# EAGLE design rfid_ctl2 (EAGLE 7.5.0)
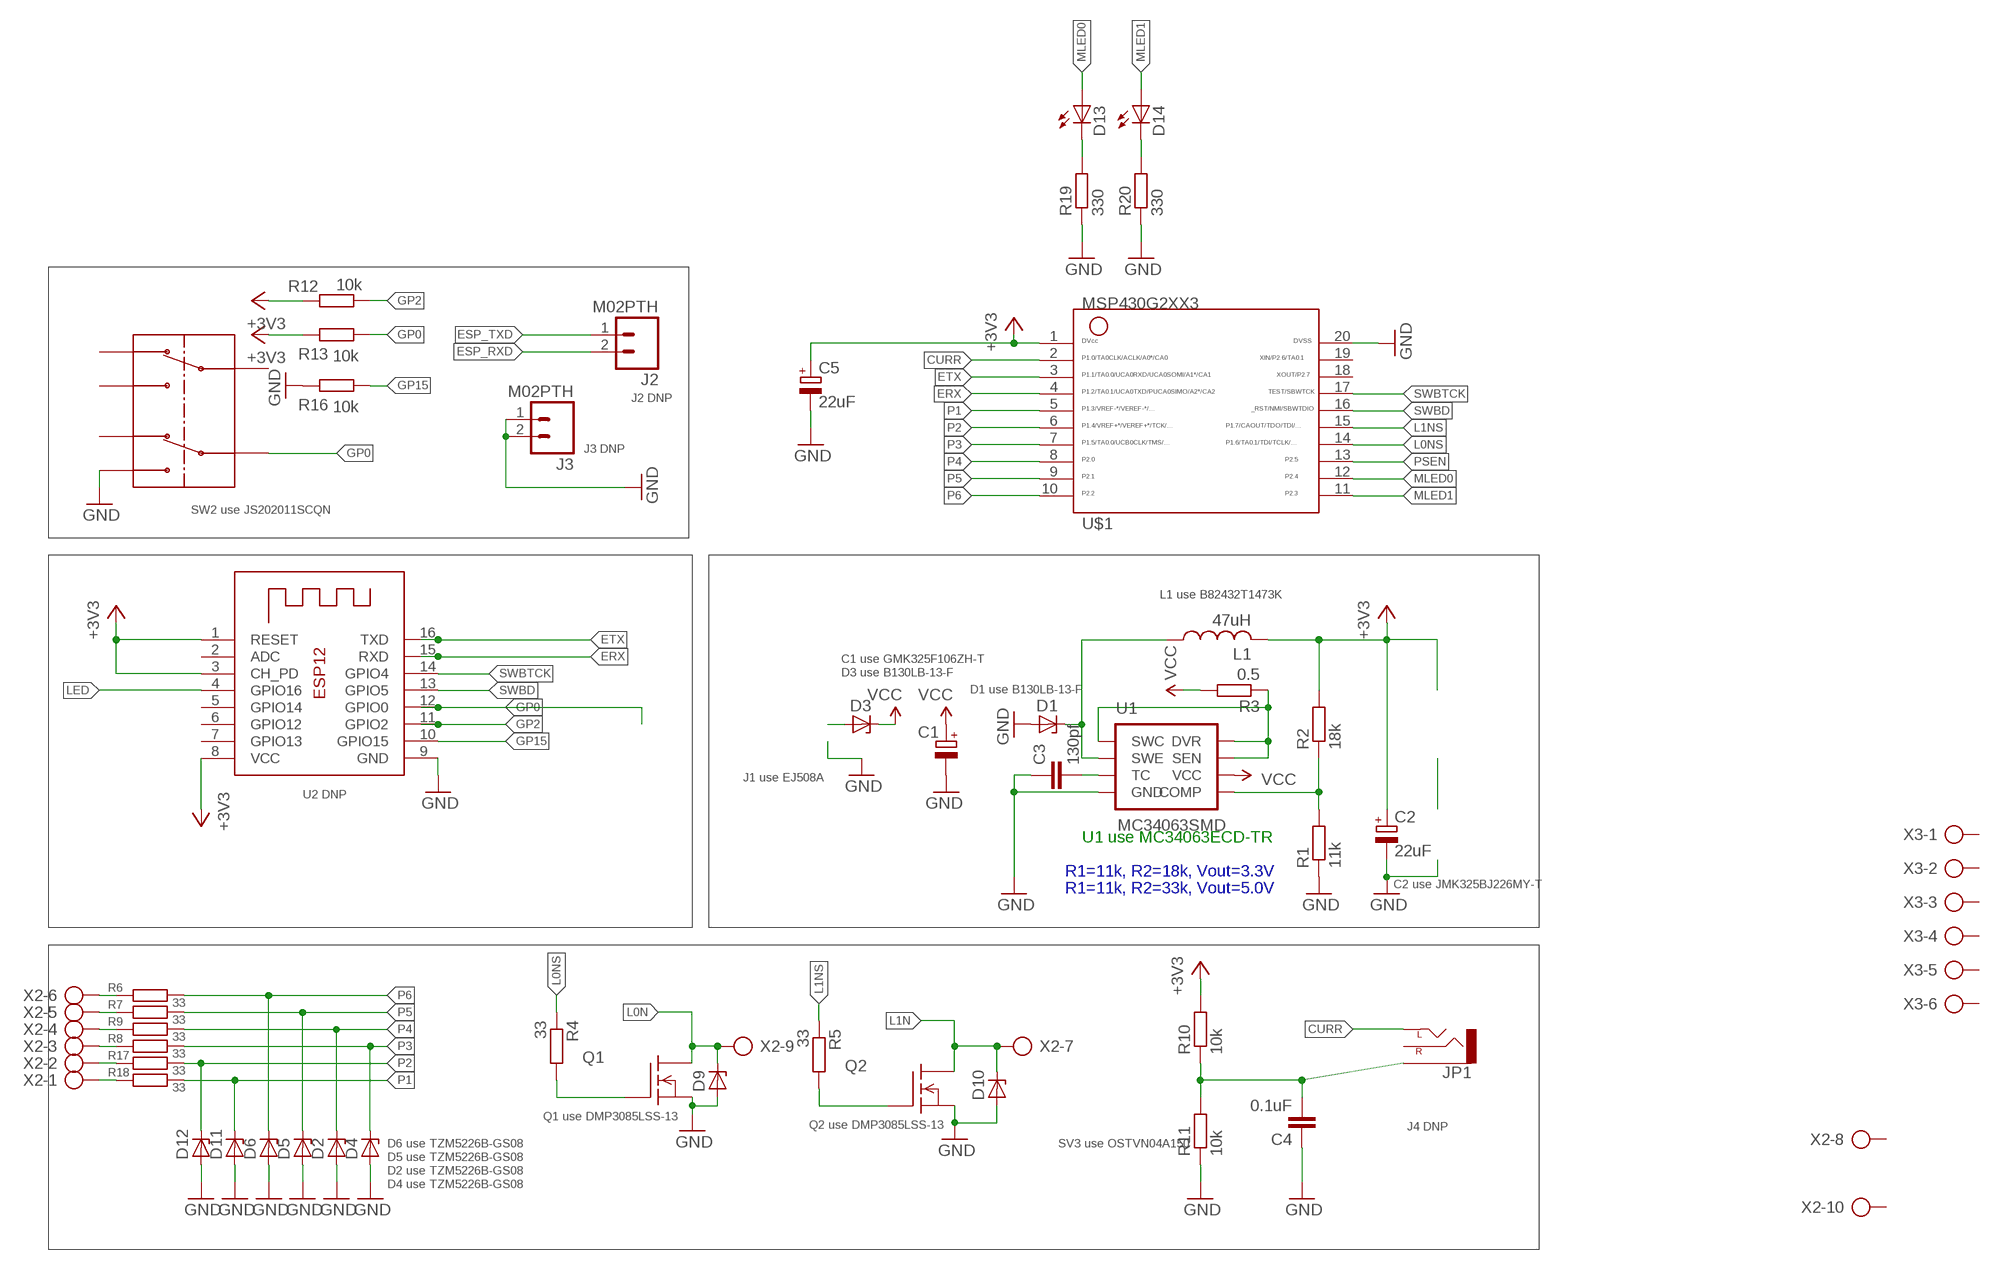
[diagram p0: schematic, sheet 1]

## Parts
C1  CPOL-EUE2.5-7  [E2,5-7]
C2  22uF  CPOL-EUE2.5-7  [E2,5-7]
C3  130pf  C-EUC0805  [C0805]
C4  0.1uF  C-EUC0603  [C0603]
C5  22uF  CPOL-EUE1.8-4  [E1,8-4]
D1  ZENER-DIODESMB  [SMB]
D2  ZENER-DIODESOD80C  [SOD80C]
D3  ZENER-DIODESMB  [SMB]
D4  ZENER-DIODESOD80C  [SOD80C]
D5  ZENER-DIODESOD80C  [SOD80C]
D6  ZENER-DIODESOD80C  [SOD80C]
D9  ZENER-DIODESMB  [SMB]
D10  ZENER-DIODESMB  [SMB]
D11  ZENER-DIODESOD80C  [SOD80C]
D12  ZENER-DIODESOD80C  [SOD80C]
D13  LED5MM  [LED5MM]
D14  LED5MM  [LED5MM]
J2  M02PTH  [1X02]
J3  M02PTH  [1X02]
JP1  AUDIO-JACKSMD2  [AUDIO-JACK-3.5MM-SMD]
L1  47uH  L-USL1812  [L1812]
Q1  FDS5680  [SO-8]
Q2  FDS5680  [SO-8]
R1  11k  R-EU_R0805  [R0805]
R2  18k  R-EU_R0805  [R0805]
R3  0.5  R-EU_R0805  [R0805]
R4  33  R-EU_R0805  [R0805]
R5  33  R-EU_R0805  [R0805]
R6  33  R-EU_R1206  [R1206]
R7  33  R-EU_R1206  [R1206]
R8  33  R-EU_R1206  [R1206]
R9  33  R-EU_R1206  [R1206]
R10  10k  R-EU_R0603  [R0603]
R11  10k  R-EU_R0603  [R0603]
R12  10k  R-EU_R0805  [R0805]
R13  10k  R-EU_R0805  [R0805]
R16  10k  R-EU_R0603  [R0603]
R17  33  R-EU_R1206  [R1206]
R18  33  R-EU_R1206  [R1206]
R19  330  R-EU_R0805  [R0805]
R20  330  R-EU_R0805  [R0805]
SW2  L202011MS02Q  [SMT]
U1  MC34063SMD  [SO08]
U2  ESP-12  [ESP-12]
U$1  G2XX3---N20  [N20]
X2  AK300/10  [AK300/10]
X3  AK300/6  [AK300/6]

## Nets
+3V3: C2.+ C5.+ L1.2 R2.2 R10.2 R12.2 R13.2 U2.1(RESET) U2.3(CH_PD) U2.8(VCC) U$1.1
CURR: JP1.TIP(LEFT) U$1.2
ERX: U2.15(RXD) U$1.4
ESP_RXD: J2.2
ESP_TXD: J2.1
ETX: U2.16(TXD) U$1.3
GND: C1.- C2.- C3.1 C4.1 C5.- D1.A D2.A D4.A D5.A D6.A D9.A D10.A D11.A D12.A J3.1 J3.2 Q1.1(S) Q1.2(S) Q1.3(S) Q2.1(S) Q2.2(S) Q2.3(S) R1.1 R11.1 R16.2 R19.1 R20.1 SW2.B1 U1.4(GND) U2.9(GND) U$1.20
GP0: R13.1 SW2.B U2.12(GPIO0)
GP2: R12.1 U2.11(GPIO2)
GP15: R16.1 U2.10(GPIO15)
L0N: D9.C Q1.5(D) Q1.6(D) Q1.7(D) Q1.8(D) X2.9
L0NS: R4.1 U$1.14
L1N: D10.C Q2.5(D) Q2.6(D) Q2.7(D) Q2.8(D) X2.7
L1NS: R5.1 U$1.15
LED: U2.4(GPIO16)
MLED0: D13.A U$1.12
MLED1: D14.A U$1.11
N$1: Q1.4(G) R4.2
N$2: C3.2 U1.3(TC)
N$3: D1.C L1.1 U1.2(SWE)
N$4: Q2.4(G) R5.2
N$5: R1.2 R2.1 U1.5(COMP)
N$6: R3.1 U1.1(SWC) U1.7(SEN) U1.8(DVR)
N$7: D3.A
N$8: R6.1 X2.6
N$9: R7.1 X2.5
N$10: R8.1 X2.4
N$11: R9.1 X2.3
N$12: C4.2 JP1.SLEEVE R10.1 R11.2
N$15: D13.K(C) R19.2
N$16: D14.K(C) R20.2
N$17: R17.1 X2.2
N$18: R18.1 X2.1
P1: D11.C R18.2 U$1.5
P2: D12.C R17.2 U$1.6
P3: D4.C R9.2 U$1.7
P4: D2.C R8.2 U$1.8
P5: D5.C R7.2 U$1.9
P6: D6.C R6.2 U$1.10
PSEN: U$1.13
SWBD: U2.13(GPIO5) U$1.16
SWBTCK: U2.14(GPIO4) U$1.17
VCC: C1.+ D3.C R3.2 U1.6(VCC)
Unconnected: JP1.RING(RIGHT) SW2.A SW2.A1 SW2.A2 SW2.B2 U2.2(ADC) U2.5(GPIO14) U2.6(GPIO12) U2.7(GPIO13) U$1.18 U$1.19 X2.8 X2.10 X3.1 X3.2 X3.3 X3.4 X3.5 X3.6

## Notes on the sheet
- J2 DNP
- J3 DNP
- SW2 use JS202011SCQN
- L1 use B82432T1473K
- C1 use GMK325F106ZH-T
- D3 use B130LB-13-F
- D1 use B130LB-13-F
- J1 use EJ508A
- U2 DNP
- U1 use MC34063ECD-TR
- R1=11k, R2=18k, Vout=3.3V
- C2 use JMK325BJ226MY-T
- R1=11k, R2=33k, Vout=5.0V
- Q1 use DMP3085LSS-13
- Q2 use DMP3085LSS-13 | J4 DNP
- D6 use TZM5226B-GS08 | SV3 use OSTVN04A150
- D5 use TZM5226B-GS08
- D2 use TZM5226B-GS08
- D4 use TZM5226B-GS08

## Library data of the parts
C1 C2 C5 = rcl:CPOL-EU: POLARIZED CAPACITOR, European symbol
C3 C4 = rcl:C-EU: CAPACITOR, European symbol
D1-D6 D9-D12 = diode:ZENER-DIODE: Z-Diode
D13 D14 = adafruit:LED: LED OSRAM: - CHIPLED LG R971, LG N971, LY N971, LG Q971, LY Q971, LO R971, LY R971 LH N974, LH R974 LS Q976, LO Q976, LY Q976 LO Q996 - Hyper CHIPLED LW Q18S LB Q993, LB Q99A, LB R99A - SideLED LS A670, LO A670, LY A670, LG A670, LP A670 LB A673, LV A673, LT A673, LW A673 LH A674 LY A675 LS A676, LA A676, LO A676, LY A676, LW A676 LS A679, LY A679, LG A679 - Hyper Micro SIDELED® LS Y876, LA Y876, LO Y876, LY Y876 LT Y87S - SmartLED LW L88C, LW L88S LB L89C, LB L89S, LG L890 LS L89K, LO L89K, LY L89K LS L896, LA L896, LO L896, LY L896 - TOPLED LS T670, LO T670, LY T670, LG T670, LP T670 LSG T670, LSP T670, LSY T670, LOP T670, LYG T670 LG T671, LOG T671, LSG T671 LB T673, LV T673, LT T673, LW T673 LH T674 LS T676, LA T676, LO T676, LY T676, LB T676, LH T676, LSB T676, LW T676 LB T67C, LV T67C, LT T67C, LS T67K, LO T67K, LY T67K, LW E67C LS E67B, LA E67B, LO E67B, LY E67B, LB E67C, LV E67C, LT E67C LW T67C LS T679, LY T679, LG T679 LS T770, LO T770, LY T770, LG T770, LP T770 LB T773, LV T773, LT T773, LW T773 LH T774 LS E675, LA E675, LY E675, LS T675 LS T776, LA T776, LO T776, LY T776, LB T776 LHGB T686 LT T68C, LB T68C - Hyper Mini TOPLED® LB M676 - Mini TOPLED Santana® LG M470 LS M47K, LO M47K, LY M47K Source: http://www.osram.convergy.de/
J2 J3 = SparkFun-Connectors:M02: Standard 2-pin 0.1" header. Use with - straight break away headers ( PRT-00116) - right angle break away headers (PRT-00553) - swiss pins (PRT-00743) - machine pins (PRT-00117) - female headers (PRT-00115) Molex polarized connector foot print use with: PRT-08233 with associated crimp pins and housings. 2.54_SCREWTERM for use with PRT-10571. 3.5mm Screw Terminal footprints for PRT-08084 5mm Screw Terminal footprints for use with PRT-08432
JP1 = SparkFun-Connectors:AUDIO-JACK: 3.5mm Audio Jack Simple 3.5mm common PCB mount audio jack. SKU: PRT-08032; PROD_ID: CONN-10353
L1 = rcl:L-US: INDUCTOR, American symbol
Q1 Q2 = transistor-fet:FDS5680: 60V N-Channel PowerTrench TM MOSFET FAIRCHILD FDS5680.pdf
R1-R13 R16-R20 = rcl:R-EU_: RESISTOR, European symbol
SW2 = JS202011SCQNC&K:L202011MS02Q
U1 = SparkFun:MC34063
U2 = adafruit:ESP-12
U$1 = TI_MSP430_v16:G2XX3---N20: MSP430G2XX1 PDIP (N) 20 Pin Package
X2 = con-ptr500:AK300/10: CONNECTOR; OC_FARNELL: unknown; OC_NEWARK: unknown
X3 = con-ptr500:AK300/6: CONNECTOR; OC_FARNELL: unknown; OC_NEWARK: unknown

## Board
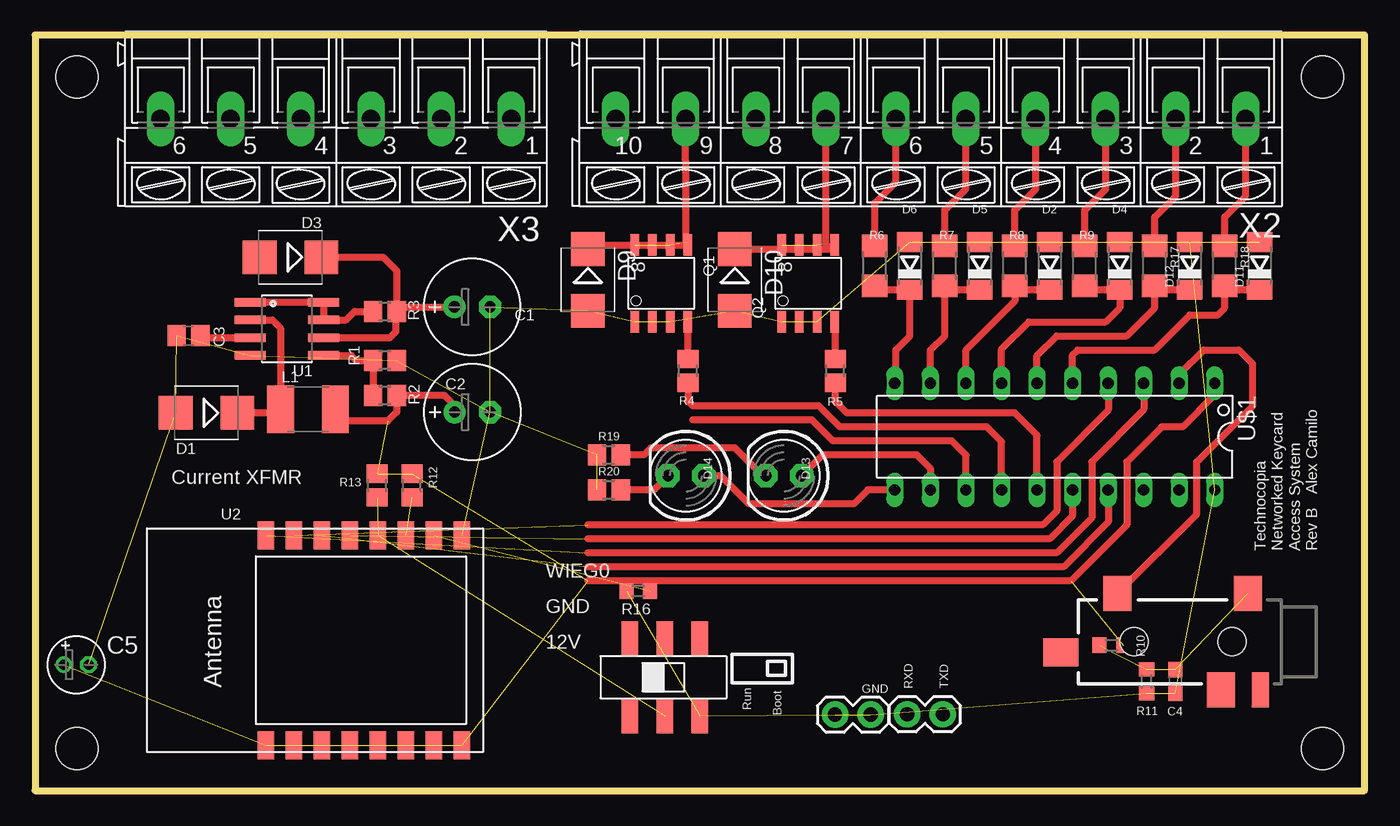
[diagram p1: board, top side]

Size 95 x 54 mm. Coordinates in mm from the lower left corner, seen from the top.
Outline: 0,0 95,0 95,54 0,54 0,0
Copper layers (1*16): Top 0.0356mm / dielectric 1.5011mm / Bottom 0.0356mm
Design rules "LaenPCBOrder *": minimum track width 6mil, minimum drill 13mil, track to track 6mil, track to pad 6mil, pad to pad 6mil, via to via 6mil, smd to smd 6mil, copper to edge 15mil, drill to drill 6mil, minimum pad ring 7mil, minimum via ring 7mil, stop-mask expansion 3mil, vias tented up to drill 30mil, thermal gap 10mil
Holes 3 mm at 3,51 92,51 92,3 3,3

### Footprints (pad centres in the part's own frame; a part is rotated, then mirrored left to right if it is on the bottom)
E2,5-7 = drill 0.813 pad 1.6: + -1.27,0 | drill 0.813 pad 1.6 octagon: - 1.27,0
C0805 = smd 1.3 x 1.5: 1 -0.85,0; 2 0.85,0
C0603 = smd 1.1 x 1: 1 -0.85,0; 2 0.85,0
E1,8-4 = drill 0.711 pad 1.168: + -0.889,0 | drill 0.711 pad 1.168 octagon: - 0.889,0
SMB = smd 2.4 x 2.4: A 2.2,0; C -2.2,0
SOD80C = smd 1.4 x 1.8: A 1.7,0; C -1.7,0
LED5MM = drill 0.813 pad 1.676 octagon: A -1.27,0; K 1.27,0
1X02 = drill 1.016 pad 1.88: 1 0,0; 2 2.54,0
AUDIO-JACK-3.5MM-SMD = smd 2 x 2.5: RING 4.3,3.45; SLEEVE 2.4,-3.45; TIP 11.7,-3.45 | smd 1.2 x 2.5: RSH 1.5,3.45 | smd 2.5 x 2: TSH 15.75,0.75 | hole 2: 3.5,0; 10.5,0
L1812 = smd 1.9 x 3.4: 1 -1.95,0; 2 1.95,0
SO-8 = smd 1.524 x 0.61: 1 -2.743,1.905; 2 -2.743,0.635; 3 -2.743,-0.635; 4 -2.743,-1.905; 5 2.743,-1.905; 6 2.743,-0.635; 7 2.743,0.635; 8 2.743,1.905
R0805 = smd 1.3 x 1.5: 1 -0.85,0; 2 0.85,0
R1206 = smd 1.6 x 1.803: 1 -1.422,0; 2 1.422,0
R0603 = smd 1 x 1.1: 1 -0.85,0; 2 0.85,0
SMT = smd 1.2 x 2.5: A 3.1,1.3; A1 0.6,1.3; A2 5.6,1.3; B 3.1,6.8; B1 0.6,6.8; B2 5.6,6.8
SO08 = smd 0.61 x 2.21: 1 -1.905,-2.616; 2 -0.635,-2.616; 3 0.635,-2.616; 4 1.905,-2.616; 5 1.905,2.616; 6 0.635,2.616; 7 -0.635,2.616; 8 -1.905,2.616
ESP-12 = smd 2 x 1.2: 1 -7.5,4.5; 2 -7.5,2.5; 3 -7.5,0.5; 4 -7.5,-1.5; 5 -7.5,-3.5; 6 -7.5,-5.5; 7 -7.5,-7.5; 8 -7.5,-9.5; 9 7.5,-9.5; 10 7.5,-7.5; 11 7.5,-5.5; 12 7.5,-3.5; 13 7.5,-1.5; 14 7.5,0.5; 15 7.5,2.5; 16 7.5,4.5
N20 = drill 0.813 long: 1 -11.435,-3.81; 2 -8.895,-3.81; 3 -6.355,-3.81; 4 -3.815,-3.81; 5 -1.275,-3.81; 6 1.265,-3.81; 7 3.805,-3.81; 8 6.345,-3.81; 9 8.885,-3.81; 10 11.425,-3.81; 11 11.425,3.81; 12 8.885,3.81; 13 6.345,3.81; 14 3.805,3.81; 15 1.265,3.81; 16 -1.275,3.81; 17 -3.815,3.81; 18 -6.355,3.81; 19 -8.895,3.81; 20 -11.435,3.81
AK300/10 = drill 1.321 long: 1 -22.504,0; 2 -17.501,0; 3 -12.497,0; 4 -7.493,0; 5 -2.515,0; 6 2.489,0; 7 7.493,0; 8 12.497,0; 9 17.501,0; 10 22.504,0
AK300/6 = drill 1.321 long: 1 -12.522,0; 2 -7.518,0; 3 -2.515,0; 4 2.515,0; 5 7.518,0; 6 12.522,0

### Placement (x,y rotation side)
C1  31.24,34.57 0 top
C2  31.25,27.05 0 top
C3  10.97,32.5 0 top
C4  81.47,7.8 90 top
C5  2.94,8.99 0 top
D1  12.25,27 180 top
D2  72.5,37.5 90 top
D3  18.25,38.11 180 top
D4  77.5,37.5 90 top
D5  67.5,37.5 90 top
D6  62.5,37.5 90 top
D9  39.5,36.5 270 top
D10  50,36.5 270 top
D11  87.5,37.5 90 top
D12  82.5,37.5 90 top
D13  53.5,22.5 180 top
D14  46.5,22.5 180 top
J2  64.87,5.45 180 top
J3  57.17,5.43 0 top
JP1  89.05,10.63 180 top
L1  19.5,27.25 0 top
Q1  44.75,36.25 90 top
Q2  55.25,36.25 90 top
R1  25,30.75 180 top
R2  25,28.25 0 top
R3  25,34.25 0 top
R4  46.65,30 90 top
R5  57.19,30 90 top
R6  60,37.5 270 top
R7  65,37.5 270 top
R8  70,37.5 270 top
R9  75,37.5 270 top
R10  76.92,10.38 0 top
R11  79.42,7.8 90 top
R12  26.94,21.79 90 top
R13  24.45,21.79 90 top
R16  43.1,14.26 180 top
R17  80,37.5 270 top
R18  85,37.5 270 top
R19  41,24 0 top
R20  41,21.5 0 top
SW2  48.1,12.16 180 top
U1  18,33 270 top
U2  21,10.75 90 top
U$1  72.87,25.29 180 top
X2  64,48 180 top
X3  21.5,48 180 top

### Tracks (layer width: path | path; a pad name or v marks a point on that pad's centre or on a via)
+3V3  (8 unrouted)
  Top 0.5: L1.2 22.3,26.4 25.2,26.4 25.85,27.05 R2.2 29.25,28.25 29.98,27.52 C2.+ | U$1.1 84.3,28.3 82,26 80.5,26 78,23.5 78,19 74,15 39.5,15
CURR
  Top 0.5: U$1.2 81.76,29.76 83.5,31.5 86,31.5 87,30.5 87,27.5 83,23.5 83,19.74 JP1.TIP
ERX  (1 unrouted)
  Top 0.5: U$1.4 76.68,27.18 73,23.5 73,20 72,19 39.5,19
ETX  (1 unrouted)
  Top 0.5: U$1.3 79.22,27.22 75.5,23.5 75.5,19.5 73,17 39.5,17
GND  (30 unrouted)
GP0  (2 unrouted)
GP2  (1 unrouted)
GP15  (1 unrouted)
L0N  (3 unrouted)
  Top 0.5: D9.C 39.79,38.99 Q1.5 46.5,39.15 46.5,45 X2.9
L0NS
  Top 0.5: U$1.14 69.06,24.94 68,26 57.5,26 56,27.5 47,27.5 46.65,27.85 R4.1
L1N  (3 unrouted)
  Top 0.5: D10.C 56.86,38.7 | 56.86,38.7 Q2.5 | 56.86,38.7 56.5,39.06 56.5,45 56.51,45.01 X2.7
L1NS
  Top 0.5: U$1.15 71.6,25.4 70,27 58,27 57.19,27.81 R5.1
MLED0
  Top 0.5: U$1.12 63.98,23.02 63,24 56.27,24 D13.A
MLED1
  Top 0.5: U$1.11 61.42,21.5 59.5,21.5 58.5,20.5 51,20.5 49,22.5 D14.A
N$1
  Top 0.5: R4.2 Q1.4
N$2
  Top 0.5: C3.2 11.96,32.37 U1.3
N$3
  Top 0.5: U1.2 16.96,33.63 17.55,33.05 L1.1 17.3,27 D1.C
N$4
  Top 0.5: R5.2 57.19,33.48 Q2.4
N$5
  Top 0.5: U1.5 22.61,31.09 22.95,30.75 R1.2 R2.1
N$6
  Top 0.5: R3.1 22.85,34.25 22.23,33.63 U1.7 U1.8 U1.1
N$8
  Top 0.5: R6.1 60,42 61.5,43.5 61.5,47.99 X2.6
N$9
  Top 0.5: R7.1 65,41.5 66.5,43 66.5,47.98 X2.5
N$10
  Top 0.5: R8.1 70,41.5 71.5,43 X2.4 | 71.5,48.5 X2.4 | X2.4
N$11
  Top 0.5: R9.1 75,41.5 76.5,43 X2.3
N$12  (3 unrouted)
N$15
  Top 0.5: D13.K 52,22.5 50,24.5 44,24.5 43.5,24 R19.2
N$16
  Top 0.5: D14.K 44.23,21.5 R20.2
N$17
  Top 0.5: R17.1 80,41 81.5,42.5 X2.2
N$18
  Top 0.5: R18.1 85,41 86.5,42.5 X2.1
P1
  Top 0.5: D11.C 85.28,35.8 R18.2 85,34.5 84.5,34 82.5,34 80,31.5 74.5,31.5 74.14,31.14 U$1.5
P2
  Top 0.5: D12.C 80.28,35.8 R17.2 80,34.5 78,32.5 73,32.5 71.6,31.1 U$1.6
P3
  Top 0.5: R9.2 75.28,35.8 D4.C 77.5,34.5 76.5,33.5 71,33.5 69.06,31.56 U$1.7
P4
  Top 0.5: D2.C 70.28,35.8 R8.2 70,34.98 66.52,31.5 U$1.8
P5
  Top 0.5: D5.C 65.28,35.8 R7.2 65,32.5 63.98,31.48 U$1.9
P6
  Top 0.5: R6.2 60.28,35.8 D6.C 62.5,32.5 61.5,31.5 61.5,29.16 U$1.10
PSEN
  Top 0.5: U$1.13 66.52,23.98 65.5,25 57,25 55.5,26.5 47,26.5
SWBD  (1 unrouted)
  Top 0.5: U$1.16 74.14,19.64 72.5,18 39.5,18
SWBTCK  (1 unrouted)
  Top 0.5: U$1.17 76.68,19.18 73.5,16 39.5,16
VCC
  Top 0.5: U1.6 25.36,32.37 25.8,32.8 25.8,34.2 R3.2 | D3.C 24.89,38.11 25.85,37.15 R3.2 | R3.2 26.17,34.57 C1.+

### Text on the board
tPlace: Current XFMR | Technocopia / Networked Keycard / Access System / Rev B Alex Camilo | WIEG0 | GND | 12V | GND | RXD | TXD | Run | Boot